# Altium schematic sheet captivate_proximity.SchDoc: TICAPEVM_PROXIMITY Capacitive Touch Panel PCB
size Letter; Date: Not shown in title block; ApprovedBy: Not shown in title block; CheckedBy: Not shown in title block; Author: Not shown in title block; CompanyName: Not shown in title block; DrawnBy: W. Schnoor; Engineer: Not shown in title block; Organization: Not shown in title block; Address1: Not shown in title block; Address2: Not shown in title block; Address3: Not shown in title block; Address4: Not shown in title block; DocumentNumber: 1; Revision: Use project parameter SCH_Rev; SheetNumber: 1; SheetTotal: 1; PageSetup: Record=PageOptions|CenterHorizontal=True|CenterVertical=True|PrintScale=1.00|XCorrection=1.00|YCorrection=1.00|PrintKind=0|BorderSize=5000000|LeftOffset=0|BottomOffset=0|Orientation=2|PaperLength=1000|PaperWidth=1000|Scale=100|PaperSource=15|PrintQuality=600|MediaType=1|DitherType=10|PaperKind=Letter|PrintScaleMode=1; CurrentTime: Not shown in title block; CurrentDate: Not shown in title block; Time: Not shown in title block; DocumentFullPathAndName: Not shown in title block; DocumentName: Not shown in title block; ModifiedDate: Not shown in title block; ImagePath: Not shown in title block
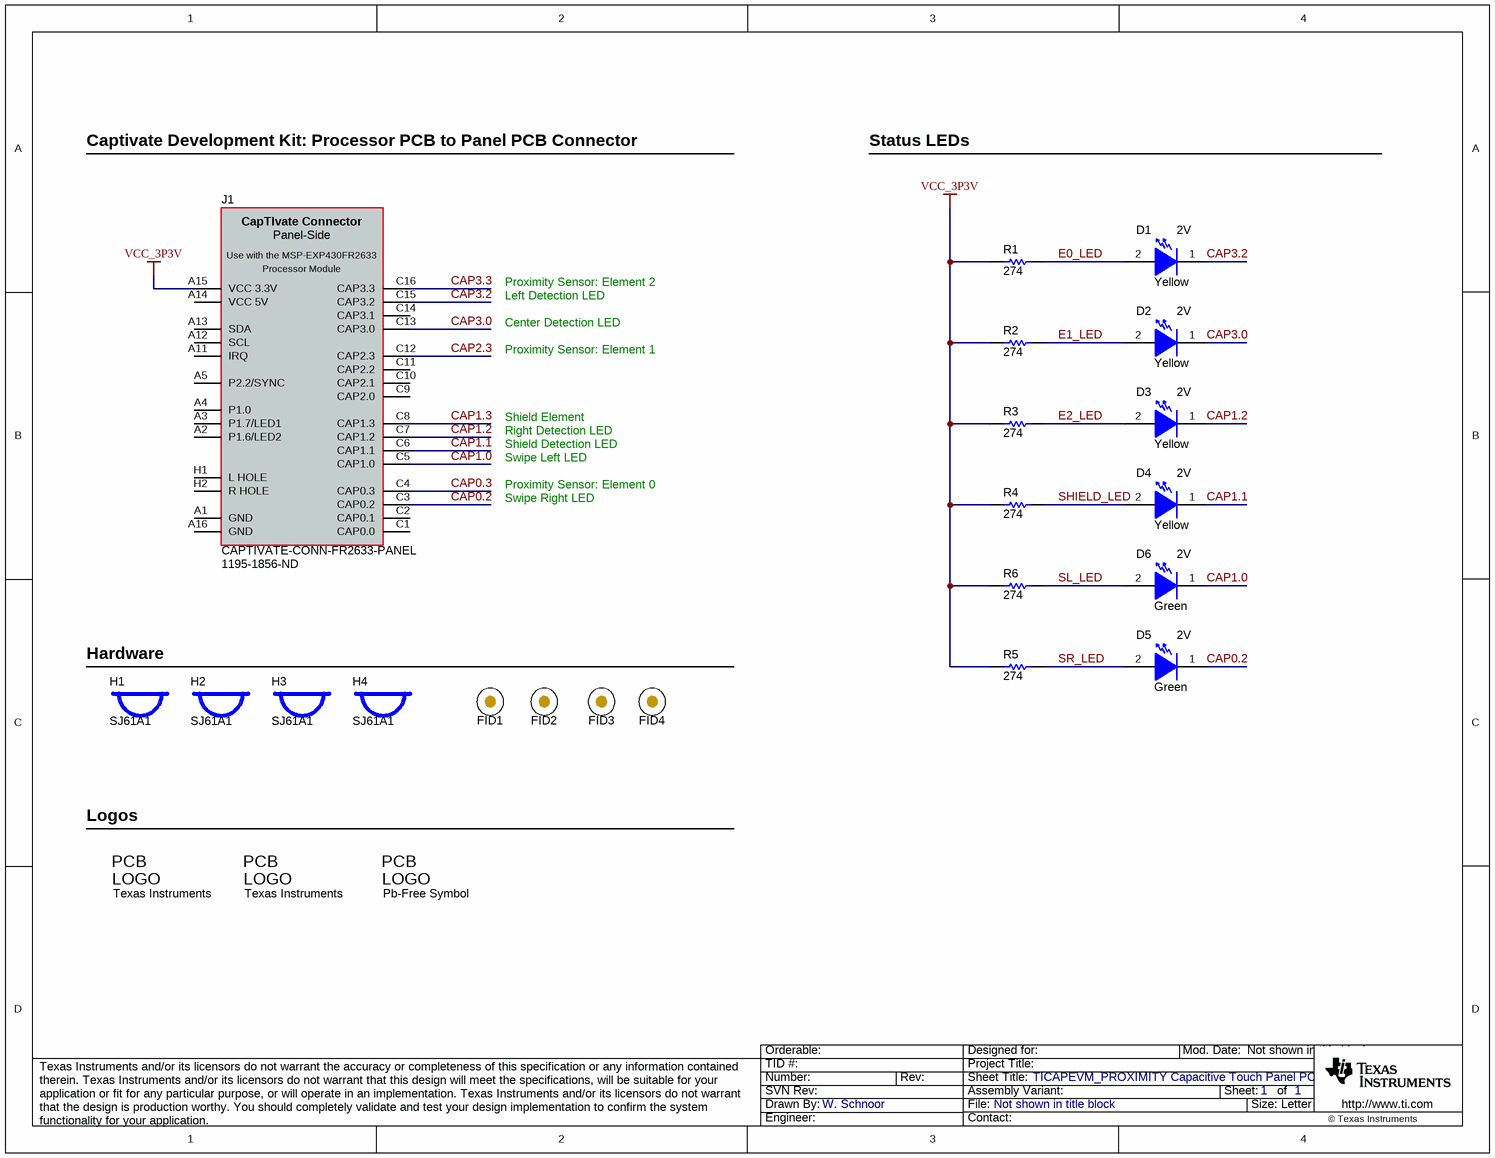
[diagram p0: captivate_proximity.SchDoc]

## Parts
D1  value Yellow  Value2: 2V  [WL-SMCW_YELLOW]  (hidden comment: 150060YS75000)
D2  value Yellow  Value2: 2V  [WL-SMCW_YELLOW]  (hidden comment: 150060YS75000)
D3  value Yellow  Value2: 2V  [WL-SMCW_YELLOW]  (hidden comment: 150060YS75000)
D4  value Yellow  Value2: 2V  [WL-SMCW_YELLOW]  (hidden comment: 150060YS75000)
D5  value Green  Value2: 2V  [WL-SMCW_GREEN]  (hidden comment: 150060VS75000)
D6  value Green  Value2: 2V  [WL-SMCW_GREEN]  (hidden comment: 150060VS75000)
FID1  Fiducial  [Fiducial10-20]  (value not drawn)
FID2  Fiducial  [Fiducial10-20]  (value not drawn)
FID3  Fiducial  [Fiducial10-20]  (value not drawn)
FID4  Fiducial  [Fiducial10-20]  (value not drawn)
H1  SJ61A1  [Bumpon_SJ61A1]
H2  SJ61A1  [Bumpon_SJ61A1]
H3  SJ61A1  [Bumpon_SJ61A1]
H4  SJ61A1  [Bumpon_SJ61A1]
J1  CAPTIVATE-CONN-FR2633-PANEL  Supplier Part Number 1: 1195-1856-ND  [CAPTIVATE-CONN-48]
LeadFreeLogo  Pb-Free Symbol  [Pb-Free_Overlay_Medium]  (no BOM)
R1  ValueDisplayed: 274  [0603]  (hidden comment: CRCW0603274RFKEA)
R2  ValueDisplayed: 274  [0603]  (hidden comment: CRCW0603274RFKEA)
R3  ValueDisplayed: 274  [0603]  (hidden comment: CRCW0603274RFKEA)
R4  ValueDisplayed: 274  [0603]  (hidden comment: CRCW0603274RFKEA)
R5  ValueDisplayed: 274  [0603]  (hidden comment: CRCW0603274RFKEA)
R6  ValueDisplayed: 274  [0603]  (hidden comment: CRCW0603274RFKEA)
TI_Logo  Texas Instruments  [TI_Horizontal_Overlay_Small]  (no BOM)
TILogo_Back  Texas Instruments  [TI_Horizontal_Overlay_Medium]  (no BOM)

## Nets
VCC_3P3V: J1.A15(VCC_3.3V) R1.1 R2.1 R3.1 R4.1 R5.1 R6.1
CAP0.2: D5.1(K) J1.C3(CAP0.2)
CAP0.3: J1.C4(CAP0.3)
CAP1.0: D6.1(K) J1.C5(CAP1.0)
CAP1.1: D4.1(K) J1.C6(CAP1.1)
CAP1.2: D3.1(K) J1.C7(CAP1.2)
CAP1.3: J1.C8(CAP1.3)
CAP2.3: J1.C12(CAP2.3)
CAP3.0: D2.1(K) J1.C13(CAP3.0)
CAP3.2: D1.1(K) J1.C15(CAP3.2)
CAP3.3: J1.C16(CAP3.3)
E0_LED: D1.2(A) R1.2
E1_LED: D2.2(A) R2.2
E2_LED: D3.2(A) R3.2
SHIELD_LED: D4.2(A) R4.2
SL_LED: D6.2(A) R6.2
SR_LED: D5.2(A) R5.2

Not connected (* = marked no-connect by the designer): J1 A1(GND) A2(P1.6/LED2) A3(P1.7/LED1) A4(P1.0) A5(P2.2/SYNC) A11(IRQ) A12(SCL) A13(SDA) A14(VCC_5V) A16(GND) C1(CAP0.0) C2(CAP0.1) C9(CAP2.0) C10(CAP2.1) C11(CAP2.2) C14(CAP3.1) H1(L_HOLE) H2(R_HOLE)

## Notes on the sheet
- Captivate Development Kit: Processor PCB to Panel PCB Connector
- Status LEDs
- Proximity Sensor: Element 2
- Left Detection LED
- Proximity Sensor: Element 1
- Center Detection LED
- Right Detection LED
- Shield Element
- Proximity Sensor: Element 0
- Swipe Right LED
- Shield Detection LED
- Swipe Left LED
- (near H1) Hardware
- (near TI_Logo) Logos
- Drawn By:
- SVN Rev:
- Number:
- TID #:
- Orderable:
- Rev:
- Sheet Title:
- File:
- Project Title:
- Designed for:
- Assembly Variant:
- Mod. Date:
- Sheet:
- Size:
- of
- Letter
- http://www.ti.com
- Texas Instruments and/or its licensors do not warrant the accuracy or completeness of this specification or any information contained therein. Texas Instruments and/or its licensors do not warrant that this design will meet the specifications, will be suitable for your application or fit for any particular purpose, or will operate in an implementation. Texas Instruments and/or its licensors do not warrant that the design is production worthy. You should completely validate and test your design implementation to confirm the system functionality for your application.
- Engineer:
- Contact:
- © Texas Instruments
- (in symbol CAPTIVATE-CONN-MSP-EXP430FR2633-PANEL) CapTIvate Connector; Panel-Side; Use with the MSP-EXP430FR2633; Processor Module
- (in symbol Pb-Free) PCB; LOGO
- (in symbol TI_Logo) PCB; LOGO

## Library data of the parts
D1-D4 = 150060YS75000: LED, Yellow, SMD; Manufacturer: Wurth Elektronik eiSos; Type: AlInGaP; Vf_V: 2; Io_A: 0.02; Value1: W; U/M: EA; CompType: LED; PartNumber: 150060YS75000; SymbolVersion: 2008-11-06; MountType: SMT; RoHS: Y; PackageReference: LED_0603; Color: yellow; Published: 2008-07-11; Publisher: Texas Instruments; ComponentLink1URL: http://katalog.we-online.de/led/datasheet/150060YS75000.pdf; ComponentLink1Description: Datasheet link; LatestRevisionDate: 2014-11-23; Supplier 1: Digi-Key; Supplier Part Number 1: 732-4981-1-ND
D5 D6 = 150060VS75000: LED, Green, SMD; Manufacturer: Wurth Elektronik eiSos; Type: AlInGaP; Vf_V: 2; Io_A: 0.02; Value1: W; U/M: EA; CompType: LED; PartNumber: 150060VS75000; SymbolVersion: 2008-11-06; MountType: SMT; RoHS: Y; PackageReference: LED_0603; Color: green; Published: 2008-07-11; Publisher: Texas Instruments; ComponentLink1URL: http://katalog.we-online.de/led/datasheet/150060VS75000.pdf; ComponentLink1Description: Datasheet link; LatestRevisionDate: 2014-11-23; Supplier 1: Digi-Key; Supplier Part Number 1: 732-4980-1-ND
FID1-FID4 = Fiducial: Fiducial mark.  There is nothing to buy or mount.; SymbolCreator: codlsc; SymbolVersion: 2009-11-4; CompType: Fiducial; PackageReference: N/A; ClassName: FiducialMark; Manufacturer: N/A; PartNumber: N/A; MountType: N/A; Publisher: Texas Instruments; LatestRevisionDate: 2014-10-27; LatestRevisionNote: Added Alternate PartNumber and Alternate Manufacturer parameters to appropriate components.
H1-H4 = SJ61A1: Bumpon, Cylindrical, 0.312 X 0.200, Black; Manufacturer: 3M; SymbolCreator: a0412235; SymbolVersion: 2012-03-04; CompType: Bumpon; PartNumber: SJ61A1; RoHS: Y; PackageReference: Black Bumpon; MountType: N/A; ComponentLink1Description: Datasheet Link; ComponentLink1URL: http://multimedia.3m.com/mws/mediawebserver?mwsId=66666UF6EVsSyXTtOxTXoxMtEVtQEVs6EVs6EVs6E666666--&fn=SJxxA1.pdf; Publisher: Texas Instruments; LatestRevisionDate: 2014-11-19; Supplier 1: Digi-Key; Supplier Part Number 1: SJ5746-0-ND; Supplier 2: Mouser; Supplier Part Number 2: 517-SJ-61A1
J1 = CAPTIVATE-CONN-MSP-EXP430FR2633-PANEL: CapTIvate Panel-Side Connector, 3x16, 100mil, TH, RA, M, MSP-EXP430FR2633; Manufacturer: Used in BOM report; SymbolCreator: a0273983; U/M: EA, IN, or GM; SymbolVersion: 2015-1-5; MountType: SMT, TH, or N/A; RoHS: Y; PartNumber: CAPTIVATE-CONN-FR2633-PANEL; PackageReference: eg:  0603, used in PnP report; ComponentLink1Description: Datasheet Link; CompType: Connector; Alternate PartNumber: -; Alternate Manufacturer: -; Supplier 1: Digi-Key; Supplier 2: Digi-Key; Supplier Part Number 2: 609-2112-ND
LeadFreeLogo = Pb-Free: SymbolCreator: a0412235; SymbolVersion: 2011-08-22; Published: 2009-03-03; Publisher: Texas Instruments; LatestRevisionDate: 2014-11-20
R1-R6 = CRCW0603274RFKEA: RES, 274, 1%, 0.1 W, 0603; Manufacturer: Vishay-Dale; CompType: Resistor; Value: 274; Value_Code: 274R; Tolerance_%: 1; Power_W: 0.1; Value2: 0.1W; VDC_V: 75; TempCo: 100 ppm/C; EIA_Code: E96; U/M: EA; SymbolVersion: 2009-05-29; PartNumber: CRCW0603274RFKEA; PackageReference: 0603; RoHS: Y; Res_ohm: 274; Value1: 1%; MountType: SMT; Technology: Thick Film; Published: 2008-06-26; Publisher: Texas Instruments; LatestRevisionDate: 2014-12-01; ComponentLink1Description: Datasheet link; ComponentLink1URL: http://www.vishay.com/docs/20035/dcrcwe3.pdf; Supplier 1: Digi-Key; Supplier Part Number 1: 541-274HCT-ND; Supplier 2: Mouser; Supplier Part Number 2: 71-CRCW0603-274-E3; Supplier 3: Farnell; Supplier Part Number 3: 1469788
TI_Logo TILogo_Back = TI_Logo: Texas Instrument Corporate Signature; SymbolCreator: a0412235; SymbolVersion: 2011-08-22; ClassName: Logo; Published: 2009-03-03; Publisher: Texas Instruments; LatestRevisionDate: 2014-11-20